# EAGLE design Bus_Isolator (EAGLE 6.5.0)
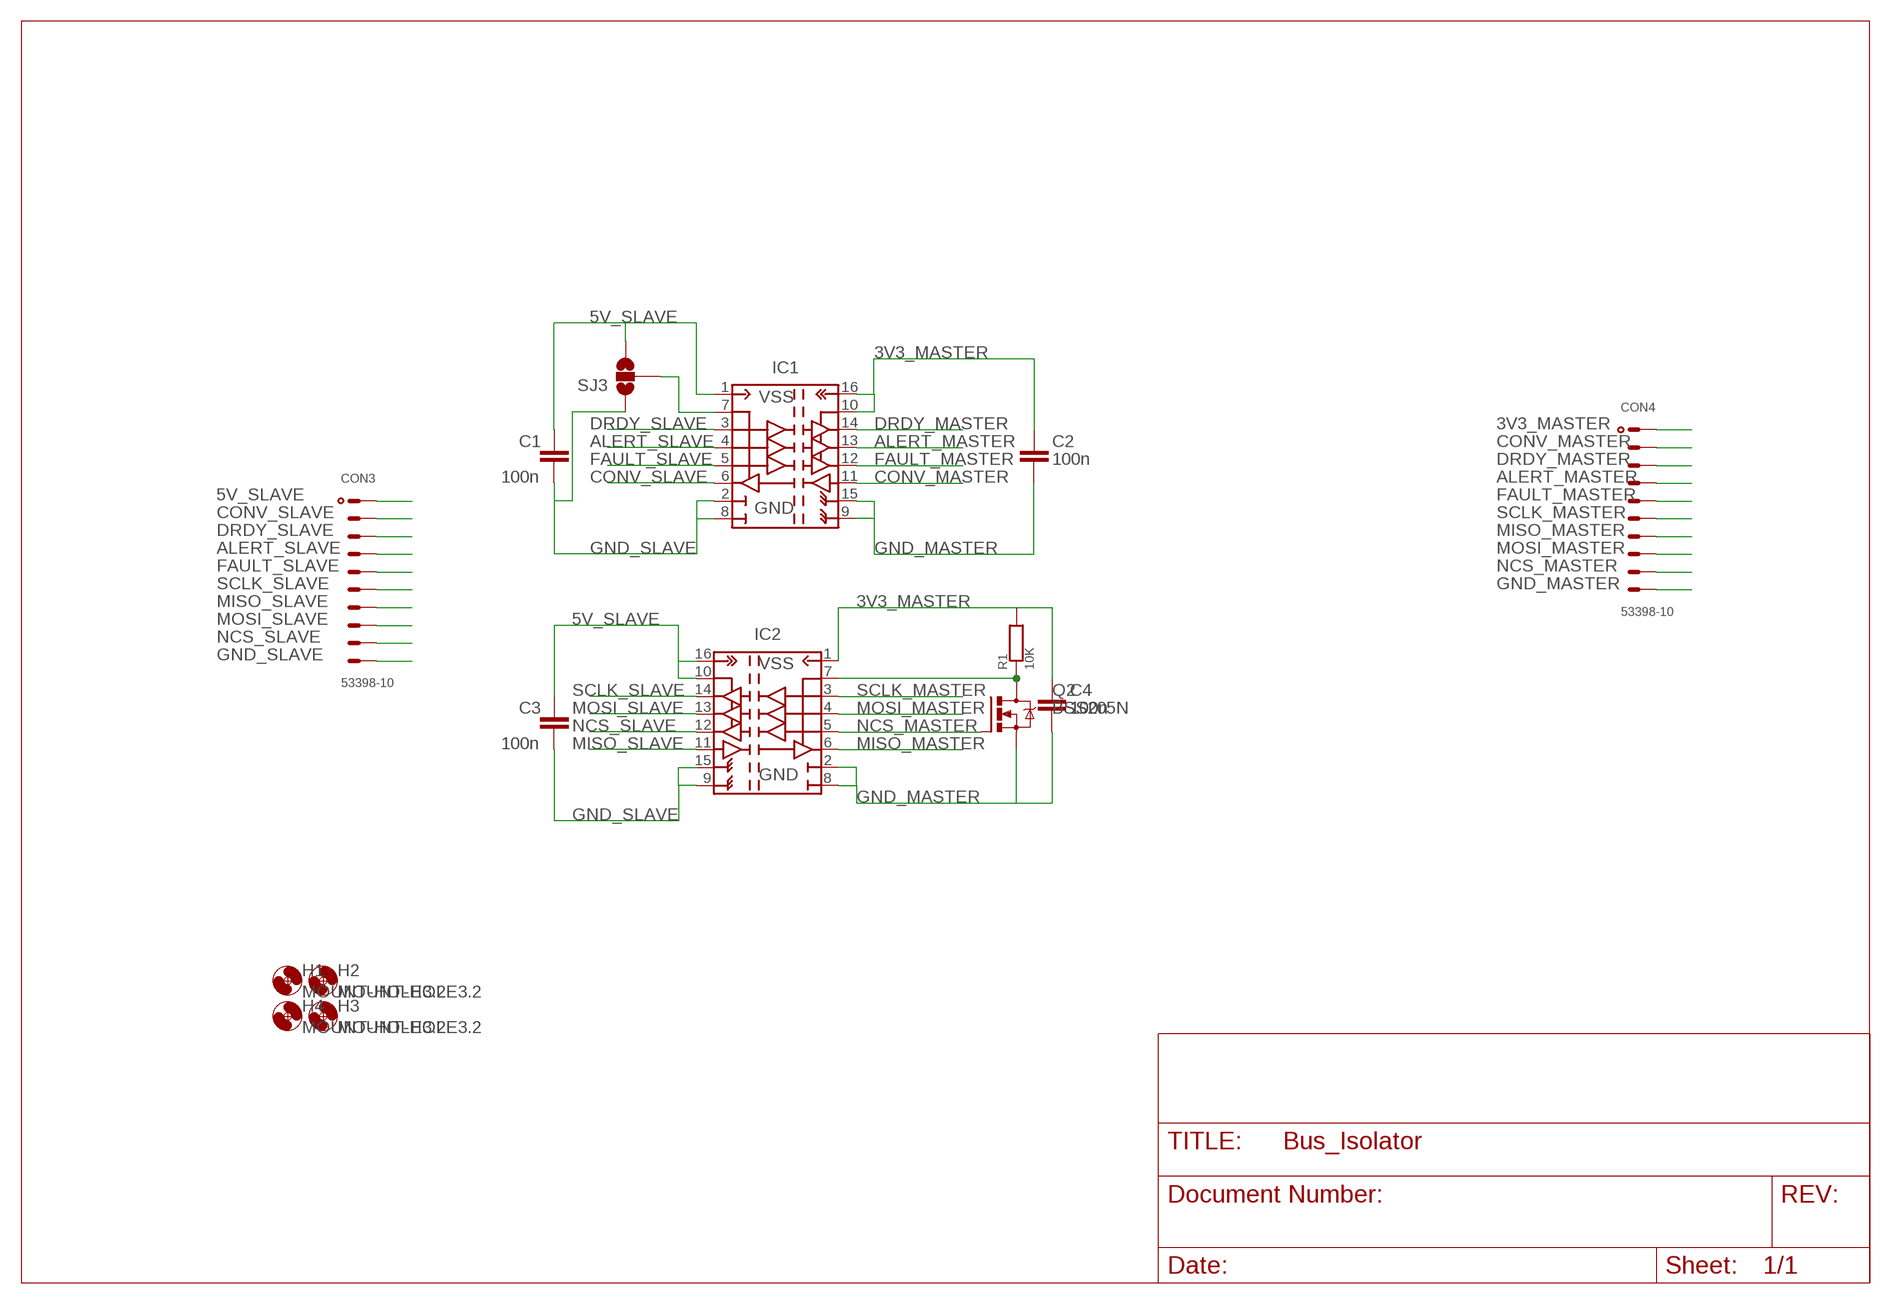
[diagram p0: schematic, sheet 1]

## Parts
C1  100n  CSTD  [C0805]
C2  100n  CSTD  [C0805]
C3  100n  CSTD  [C0805]
C4  100n  CSTD  [C0805]
CON3  53398-10  [53398-10]
CON4  53398-10  [53398-10]
H1  MOUNT-HOLE3.2  [3,2]
H2  MOUNT-HOLE3.2  [3,2]
H3  MOUNT-HOLE3.2  [3,2]
H4  MOUNT-HOLE3.2  [3,2]
IC1  ISO7241  [R-PDSO-G16]
IC2  ISO7241  [R-PDSO-G16]
Q2  BSS205N  [SOT23]
R1  10K  R  [R0805]
SJ3  SOLDERJUMPER_2WAYS  [SJ_3]

## Nets
3V3_MASTER: C2.2 C4.2 CON4.1 IC1.10(EN2) IC1.16(VCC2) IC2.1(VCC1) R1.2
5V_SLAVE: C1.2 C3.2 CON3.1 IC1.1(VCC1) IC2.10(EN2) IC2.16(VCC2) SJ3.3
ALERT_MASTER: CON4.4 IC1.13(OUT_B)
ALERT_SLAVE: CON3.4 IC1.4(IN_B)
CONV_MASTER: CON4.2 IC1.11(IN_D)
CONV_SLAVE: CON3.2 IC1.6(OUT_D)
DRDY_MASTER: CON4.3 IC1.14(OUT_A)
DRDY_SLAVE: CON3.3 IC1.3(IN_A)
FAULT_MASTER: CON4.5 IC1.12(OUT_C)
FAULT_SLAVE: CON3.5 IC1.5(IN_C)
GND_MASTER: C2.1 C4.1 CON4.10 IC1.9(GND22) IC1.15(GND21) IC2.2(GND11) IC2.8(GND12) Q2.2(S)
GND_SLAVE: C1.1 C3.1 CON3.10 IC1.2(GND11) IC1.8(GND12) IC2.9(GND22) IC2.15(GND21) SJ3.1
MISO_MASTER: CON4.7 IC2.6(OUT_D)
MISO_SLAVE: CON3.7 IC2.11(IN_D)
MOSI_MASTER: CON4.8 IC2.4(IN_B)
MOSI_SLAVE: CON3.8 IC2.13(OUT_B)
N$1: IC1.7(EN1) SJ3.2
N$2: IC2.7(EN1) Q2.3(D) R1.1
NCS_MASTER: CON4.9 IC2.5(IN_C) Q2.1(G)
NCS_SLAVE: CON3.9 IC2.12(OUT_C)
SCLK_MASTER: CON4.6 IC2.3(IN_A)
SCLK_SLAVE: CON3.6 IC2.14(OUT_A)

## Library data of the parts
C1-C4 = useful:C
CON3 CON4 = con-molex:53?-10: CONNECTOR wire to board 1.25 mm (.049 inch) pitch header
H1-H4 = holes:MOUNT-HOLE: MOUNTING HOLE with drill center marker
IC1 IC2 = ti:ISO7241
Q2 = infineon:BSS205N: Infineon Small Signal Transistor, OptiMOS 2 Technology, 20V, 2.5A SOT23
R1 = useful:R
SJ3 = SparkFun:SOLDERJUMPER_2WAY: Solder Jumper 2 way solder jumper

## Board
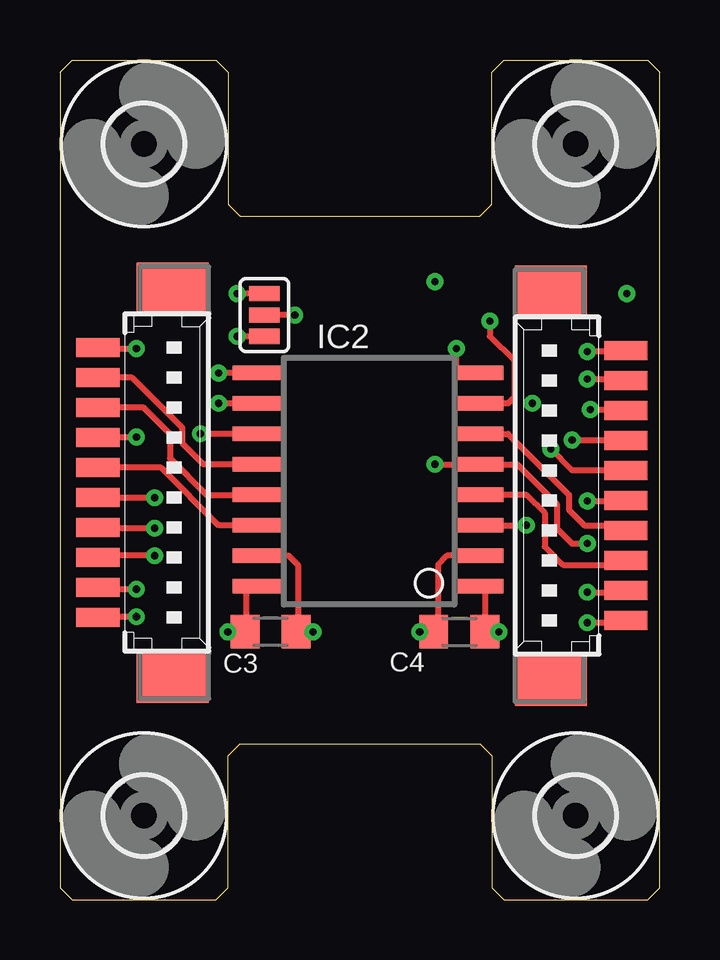
[diagram p1: board, top side]
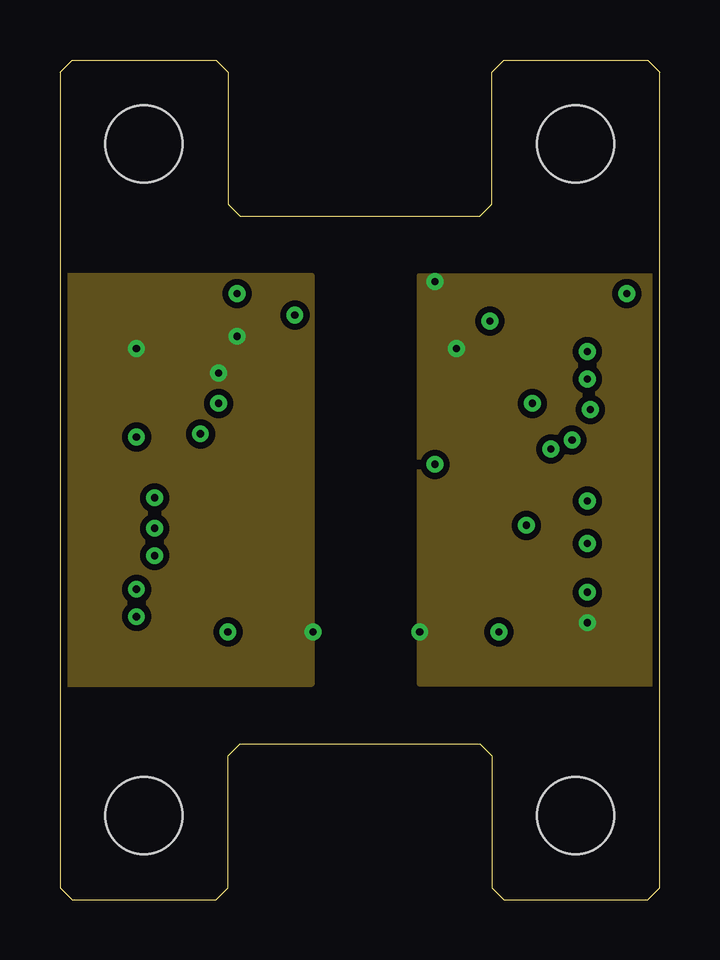
[diagram p2: board, inner layer Route2]
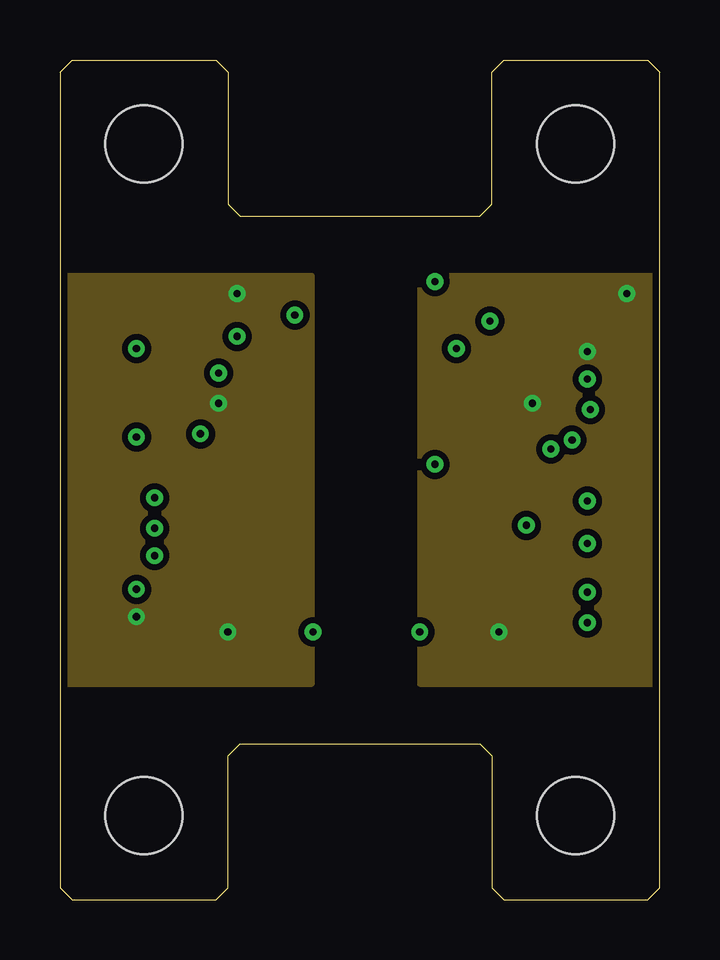
[diagram p3: board, inner layer Route15]
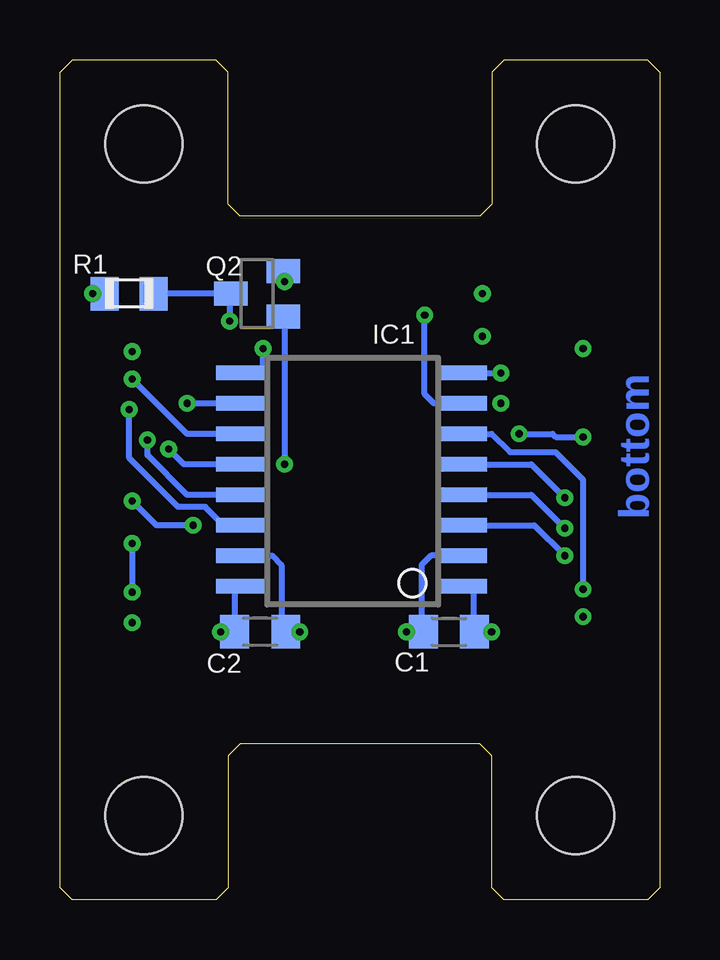
[diagram p4: board, bottom side, seen from below]

Size 25 x 35 mm. Coordinates in mm from the lower left corner, seen from the top.
Outline: 25,0.5 25,34.5 24.5,35 18.5,35 18,34.5 18,29 17.5,28.5 7.5,28.5 7,29 7,34.5 6.5,35 0.5,35 0,34.5 0,0.5 0.5,0 6.5,0 7,0.5 7,6 7.5,6.5 17.5,6.5 18,6 18,0.5 18.5,0 24.5,0 25,0.5
Copper layers (1+2*15+16): Top 0.035mm / dielectric 0.2mm / Route2 0.035mm / dielectric 0.5mm / Route15 0.035mm / dielectric 0.2mm / Bottom 0.035mm
Design rules "ats_35u_4layer_2 *": minimum track width 10mil, minimum drill 0.2mm, track to track 10mil, track to pad 10mil, pad to pad 10mil, via to via 10mil, smd to smd 10mil, copper to edge 0.3mm, drill to drill 8mil, minimum pad ring 10mil, minimum via ring 0.2mm, stop-mask expansion 4mil, vias tented up to drill 0mil, thermal gap 10mil

### Footprints (pad centres in the part's own frame; a part is rotated, then mirrored left to right if it is on the bottom)
C0805 = smd 1.2 x 1.4: 1 -1.066,0; 2 1.066,0
53398-10 = smd 0.8 x 1.8: 1 5.625,-2.5; 2 4.375,-2.5; 3 3.125,-2.5; 4 1.875,-2.5; 5 0.625,-2.5; 6 -0.625,-2.5; 7 -1.875,-2.5; 8 -3.125,-2.5; 9 -4.375,-2.5; 10 -5.625,-2.5 | smd 2.1 x 3: S1 8.125,0.625; S2 -8.125,0.625
3,2 = hole 3.2: 0,0
R-PDSO-G16 = smd 0.6 x 2: 1 -3.937,-4.649; 2 -2.667,-4.649; 3 -1.397,-4.649; 4 -0.127,-4.649; 5 1.143,-4.649; 6 2.413,-4.649; 7 3.683,-4.649; 8 4.953,-4.649; 9 4.953,4.651; 10 3.683,4.651; 11 2.413,4.651; 12 1.143,4.651; 13 -0.127,4.651; 14 -1.397,4.651; 15 -2.667,4.651; 16 -3.937,4.651
SOT23 = smd 1 x 1.4: 1 -0.95,-1.1; 2 0.95,-1.1; 3 0,1.1
R0805 = smd 1.168 x 1.397: 1 -1.016,0; 2 1.016,0
SJ_3 = smd 0.635 x 1.27: 1 -0.889,0; 2 0,0; 3 0.889,0

### Placement (x,y rotation side)
C1  8.78,11.16 0 bottom
C2  16.65,11.16 180 bottom
C3  8.78,11.16 180 top
C4  16.65,11.16 0 top
CON3  4.08,17.38 270 top
CON4  21.1,17.25 90 top
H1  21.5,3.5 0 top
H2  21.5,31.5 0 top
H3  3.5,3.5 0 top
H4  3.5,31.5 0 top
IC1  12.84,17 90 bottom
IC2  12.84,17 90 top
Q2  16.78,25.26 90 bottom
R1  22.11,25.26 180 bottom
SJ3  8.52,24.37 90 top

### Tracks (layer width: path | path; a pad name or v marks a point on that pad's centre or on a via)
3V3_MASTER  (via drill 0.3)
  Top 0.254: v18.3,11.16 C4.2 17.72,13.06 IC2.1 | v21.99,22.84 23.51,22.84 23.55,22.88 CON4.1
  Bottom 0.254: v18.3,11.16 C4.2 17.72,13.06 IC1.16 | IC1.10 v19.7,20.68 | R1.2 v23.64,25.26
  pour Route15: 15,9 27.5,9 27.5,26 15,26
5V_SLAVE  (via drill 0.3)
  Top 0.254: v7,11.16 C3.2 7.71,11.24 7.76,11.29 7.76,13.06 IC1.1 | IC2.10 v6.62,20.68 | SJ3.3 v7.38,25.26 | v3.19,11.79 1.79,11.79 1.76,11.76 CON3.1
  Bottom 0.254: IC1.1 7.76,13.06 7.76,11.16 C3.2 v7,11.16
  pour Route15: 10.5,26 -0.5,26 -0.5,9 10.5,9
ALERT_MASTER  (via drill 0.3)
  Top 0.254: v21.35,19.16 23.51,19.16 | 23.51,19.16 23.68,19.16 | CON4.4 23.54,19.13 23.51,19.16
  Bottom 0.254: IC1.13 19.7,16.87 21.35,18.53 v21.35,19.16
ALERT_SLAVE  (via drill 0.3)
  Top 0.254: v3.95,15.48 1.61,15.48 CON3.4
  Bottom 0.254: IC1.4 5.35,16.87 v3.95,15.48
CONV_MASTER  (via drill 0.3)
  Top 0.254: v21.99,21.7 23.53,21.7 CON4.2
  Bottom 0.254: IC1.11 19.7,19.41 v21.99,21.7
CONV_SLAVE  (via drill 0.3)
  Top 0.254: v3.19,12.94 1.65,12.94 CON3.2
  Bottom 0.254: IC1.6 7,19.41 6.24,18.65 4.33,18.65 3.19,17.51 v3.19,12.94
DRDY_MASTER  (via drill 0.3)
  Top 0.254: v22.11,20.43 23.55,20.43 CON4.3
  Bottom 0.254: IC1.14 18.18,15.6 18.94,16.37 20.08,16.37 22.11,18.4 v22.11,20.43
DRDY_SLAVE  (via drill 0.3)
  Top 0.254: v3.95,14.33 1.66,14.33 CON3.3
  Bottom 0.254: IC1.3 5.22,15.6 v3.95,14.33
FAULT_MASTER  (via drill 0.3)
  Top 0.254: CON4.5 21.35,17.89 v20.46,18.78
  Bottom 0.254: IC1.12 19.83,18.14 v20.46,18.78
FAULT_SLAVE  (via drill 0.3)
  Top 0.254: v3.95,16.75 1.59,16.75 CON3.5
  Bottom 0.254: IC1.5 5.35,18.14 v3.95,16.75
GND_MASTER  (via drill 0.3)
  Top 0.254: v15,11.16 C4.1 15.64,11.16 15.76,11.29 15.76,13.95 16.14,14.33 IC2.2 | IC2.8 16.53,21.95 v16.53,22.97 | v21.99,11.54 23.51,11.54 CON4.10
  Bottom 0.254: v15,11.16 C4.1 15.64,11.16 15.76,11.29 15.76,13.95 16.14,14.33 IC1.15 | IC1.9 16.53,21.95 v16.53,22.97 | Q2.2 15.64,26.25 v15.64,25.76
  pour Route2: 15,26 27.5,26 27.5,9 15,9
GND_SLAVE  (via drill 0.3)
  Top 0.254: v10.56,11.16 C1.1 9.92,11.24 9.92,13.95 9.54,14.33 IC1.2 | IC1.8 v6.62,21.95 | SJ3.1 v7.38,23.48 | v3.19,22.97 1.79,22.97 1.76,23.01 CON3.10
  Bottom 0.254: IC1.2 9.54,14.33 9.92,13.95 9.92,11.24 C1.1 v10.56,11.16 | IC1.8 v6.62,21.95
  pour Route2: 10.5,26 -0.5,26 -0.5,9 10.5,9
MISO_MASTER
  Top 0.254: IC2.6 18.68,19.41 21.22,16.87 21.22,16.24 21.86,15.6 23.37,15.6 CON4.7 22.97,15.38
MISO_SLAVE  (via drill 0.3)
  Top 0.254: IC2.11 v5.86,19.41 | v3.19,19.29 3.16,19.26 CON3.7
  Bottom 0.254: v5.86,19.41 4.46,19.41 4.33,19.29 v3.19,19.29
MOSI_MASTER
  Top 0.254: IC2.4 19.45,16.87 20.21,16.11 20.21,14.71 20.97,13.95 23.42,13.95 CON4.8
MOSI_SLAVE
  Top 0.254: CON3.8 3.49,20.51 4.59,19.41 4.59,18.4 6.11,16.87 IC2.13
N$1  (via drill 0.3)
  Top 0.254: v9.79,24.37 SJ3.2
  Bottom 0.254: IC1.7 9.41,20.68 9.79,21.07 v9.79,24.37
N$2  (via drill 0.3)
  Top 0.254: v17.92,24.11 17.92,23.48 18.94,22.46 18.94,20.94 18.68,20.68 IC2.7
  Bottom 0.254: 17.92,25.26 v17.92,24.11 | 17.92,25.26 R1.1 | Q2.3 17.92,25.26
NCS_MASTER  (via drill 0.3)
  Top 0.254: v15.64,18.14 IC2.5 19.07,18.14 20.72,16.49 20.72,15.48 21.35,14.84 v21.99,14.84 | v21.99,12.81 23.6,12.81 CON4.9
  Bottom 0.254: v15.64,18.14 15.64,23.99 15.96,24.31 Q2.1 | v21.99,14.84 v21.99,12.81
NCS_SLAVE
  Top 0.254: IC2.12 5.99,18.14 5.1,19.03 5.1,19.67 3.01,21.76 CON3.9
SCLK_MASTER  (via drill 0.3)
  Top 0.254: IC2.3 v19.45,15.6 | v21.99,16.62 23.59,16.62 CON4.6
  Bottom 0.254: v19.45,15.6 20.97,15.6 v21.99,16.62
SCLK_SLAVE
  Top 0.254: IC2.14 6.62,15.6 4.22,18.01 CON3.6

### Text on the board
Bottom: bottom
tTest: BMS Host - Isolator | V2 | TERA TU Graz
bTest: April 2014, Pöschl